# EAGLE design 3D-Druck-Platine_v2_0 (EAGLE 7.4.0)
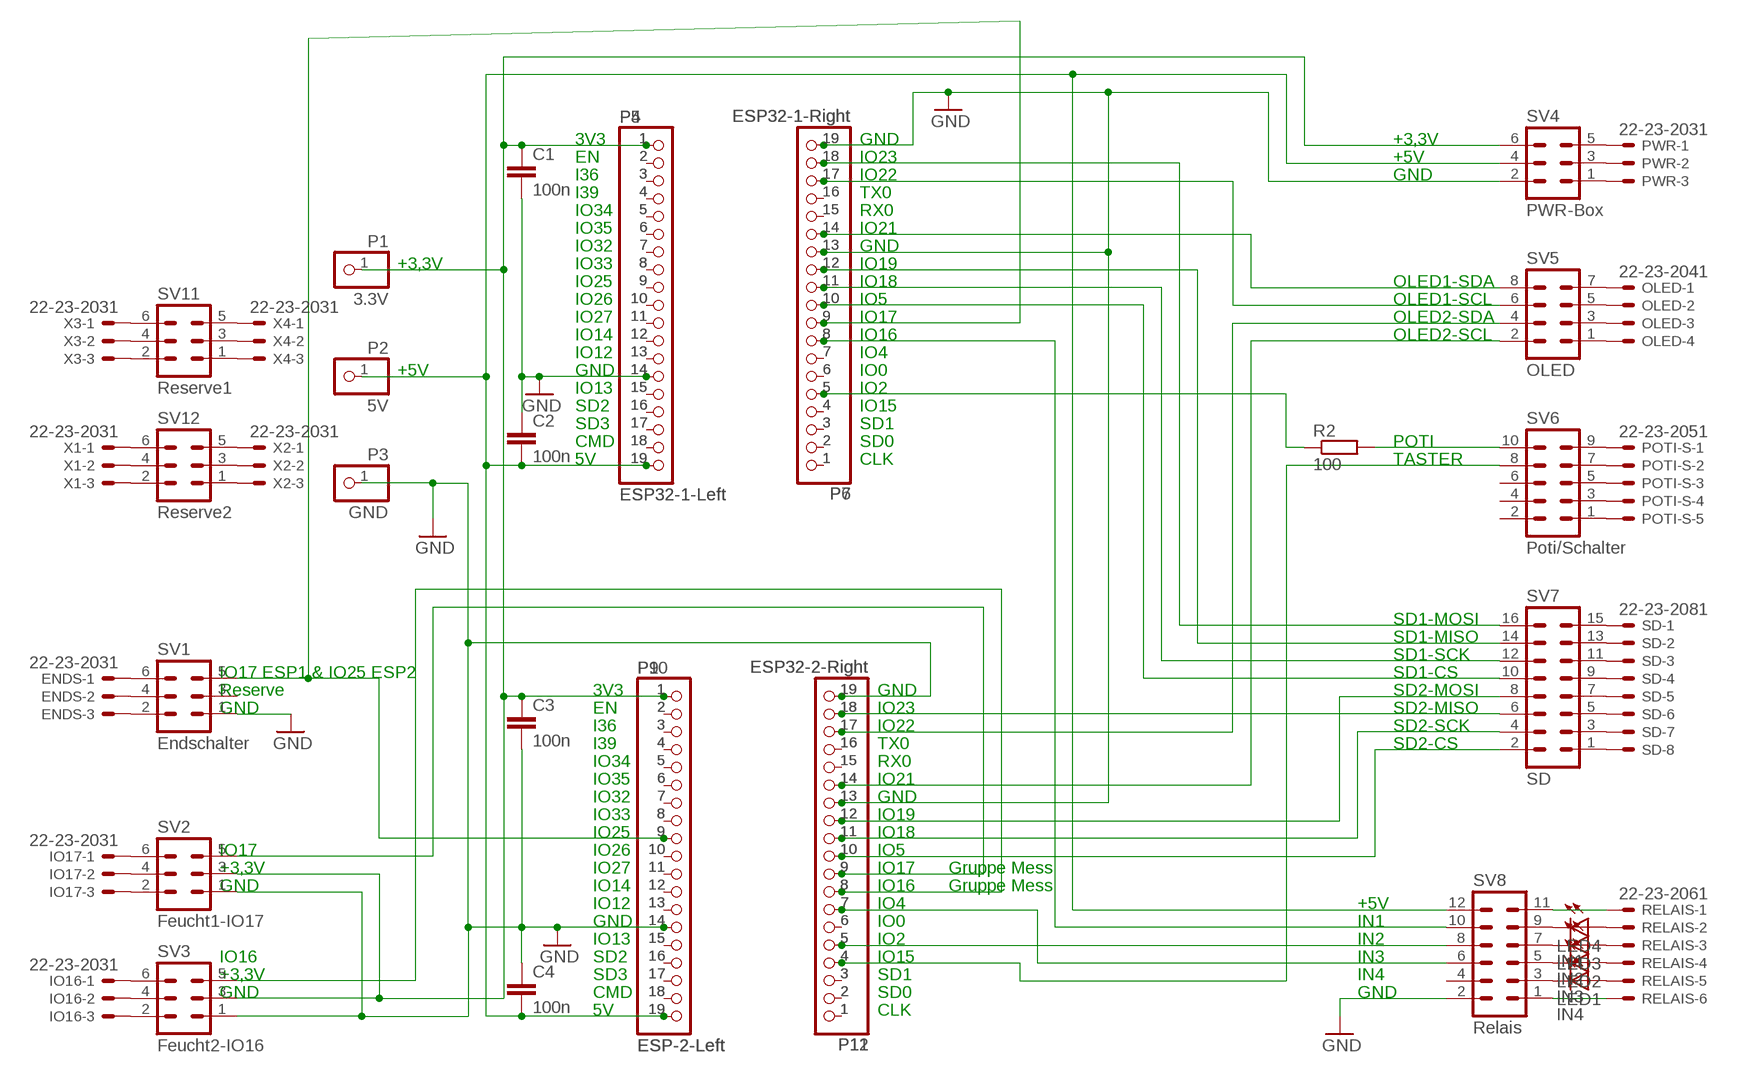
[diagram p0: schematic, sheet 1]

## Parts
C1  100n  C-EU025-024X044  [C025-024X044]
C2  100n  C-EU025-024X044  [C025-024X044]
C3  100n  C-EU025-024X044  [C025-024X044]
C4  100n  C-EU025-024X044  [C025-024X044]
ENDS  22-23-2031  [22-23-2031]
IO16  22-23-2031  [22-23-2031]
IO17  22-23-2031  [22-23-2031]
LED1  IN4  LED3MM  [LED3MM]
LED2  IN3  LED3MM  [LED3MM]
LED3  IN2  LED3MM  [LED3MM]
LED4  IN1  LED3MM  [LED3MM]
OLED  22-23-2041  [22-23-2041]
P1  3.3V  PINHD-1X1  [1X01]
P2  5V  PINHD-1X1  [1X01]
P3  GND  PINHD-1X1  [1X01]
P4  ESP32-1-Left  PINHD-1X19  [1X19]
P5  ESP32-1-Left  PINHD-1X19  [1X19]
P6  ESP32-1-Right  PINHD-1X19  [1X19]
P7  ESP32-1-Right  PINHD-1X19  [1X19]
P9  ESP-2-Left  PINHD-1X19  [1X19]
P10  ESP-2-Left  PINHD-1X19  [1X19]
P11  ESP32-2-Right  PINHD-1X19  [1X19]
P12  ESP32-2-Right  PINHD-1X19  [1X19]
POTI-S  22-23-2051  [22-23-2051]
PWR  22-23-2031  [22-23-2031]
R2  100  R-EU_0207/10  [0207/10]
RELAIS  22-23-2061  [22-23-2061]
SD  22-23-2081  [22-23-2081]
SV1  Endschalter  MA03-2  [MA03-2]
SV2  Feucht1-IO17  MA03-2  [MA03-2]
SV3  Feucht2-IO16  MA03-2  [MA03-2]
SV4  PWR-Box  MA03-2  [MA03-2]
SV5  OLED  MA04-2  [MA04-2]
SV6  Poti/Schalter  MA05-2  [MA05-2]
SV7  SD  MA08-2  [MA08-2]
SV8  Relais  MA06-2  [MA06-2]
SV11  Reserve1  MA03-2  [MA03-2]
SV12  Reserve2  MA03-2  [MA03-2]
X1  22-23-2031  [22-23-2031]
X2  22-23-2031  [22-23-2031]
X3  22-23-2031  [22-23-2031]
X4  22-23-2031  [22-23-2031]

## Nets
GND: C1.2 C2.1 C3.2 C4.1 P3.1 P4.14 P5.14 P6.13 P6.19 P7.13 P7.19 P9.14 P10.14 P11.13 P11.19 P12.13 P12.19 SV1.1 SV2.1 SV3.1 SV4.2 SV8.2
N$1: P4.2 P5.2
N$2: LED4.K(C) SV8.9
N$3: P4.3 P5.3
N$3V: C1.1 C3.1 P1.1 P4.1 P5.1 P9.1 P10.1 SV2.3 SV3.3 SV4.6
N$4: P11.8 P12.8 SV3.5
N$5: LED3.K(C) SV8.7
N$5V: C2.2 C4.2 P2.1 P4.19 P5.19 P9.19 P10.19 SV4.4 SV8.12
N$6: P4.4 P5.4
N$7: P4.5 P5.5
N$8: ENDS.1 SV1.6
N$9: P4.6 P5.6
N$10: IO17.1 SV2.6
N$11: ENDS.2 SV1.4
N$12: ENDS.3 SV1.2
N$13: IO17.2 SV2.4
N$14: IO17.3 SV2.2
N$15: IO16.1 SV3.6
N$16: IO16.2 SV3.4
N$17: IO16.3 SV3.2
N$18: PWR.1 SV4.5
N$19: PWR.2 SV4.3
N$20: LED2.K(C) SV8.5
N$21: P4.7 P5.7
N$22: P4.8 P5.8
N$23: P4.9 P5.9
N$24: P4.10 P5.10
N$25: P4.11 P5.11
N$26: P4.12 P5.12
N$27: P4.13 P5.13
N$28: P4.15 P5.15
N$29: P4.16 P5.16
N$30: P4.17 P5.17
N$31: P4.18 P5.18
N$32: P6.1 P7.1
N$33: P6.2 P7.2
N$34: P6.3 P7.3
N$35: P6.4 P7.4
N$36: PWR.3 SV4.1
N$37: P6.7 P7.7
N$38: P6.15 P7.15
N$39: P6.16 P7.16
N$40: P9.2 P10.2
N$41: P9.3 P10.3
N$42: P9.4 P10.4
N$43: P9.5 P10.5
N$44: P9.6 P10.6
N$45: P9.8 P10.8
N$46: P9.11 P10.11
N$47: P9.12 P10.12
N$48: P9.13 P10.13
N$49: P9.15 P10.15
N$50: P9.16 P10.16
N$51: P9.17 P10.17
N$52: P9.18 P10.18
N$53: P11.1 P12.1
N$54: P11.2 P12.2
N$55: P11.3 P12.3
N$56: OLED.1 SV5.7
N$57: P11.6 P12.6
N$58: P11.15 P12.15
N$59: R2.2 SV6.10
N$60: P6.6 P7.6
N$61: OLED.2 SV5.5
N$62: OLED.3 SV5.3
N$63: OLED.4 SV5.1
N$64: POTI-S.1 SV6.9
N$65: POTI-S.2 SV6.7
N$66: POTI-S.3 SV6.5
N$67: POTI-S.4 SV6.3
N$68: POTI-S.5 SV6.1
N$69: SD.1 SV7.15
N$70: SD.2 SV7.13
N$71: SD.3 SV7.11
N$72: SD.5 SV7.7
N$73: SD.6 SV7.5
N$74: SD.7 SV7.3
N$75: SD.8 SV7.1
N$76: SD.4 SV7.9
N$77: RELAIS.1 SV8.11
N$78: LED1.K(C) SV8.3
N$79: LED4.A RELAIS.2
N$80: LED3.A RELAIS.3
N$81: LED2.A RELAIS.4
N$82: RELAIS.6 SV8.1
N$83: LED1.A RELAIS.5
N$84: SV11.6 X3.1
N$85: SV11.4 X3.2
N$86: SV11.2 X3.3
N$87: SV11.5 X4.1
N$88: SV11.3 X4.2
N$89: SV11.1 X4.3
N$90: SV12.6 X1.1
N$91: SV12.4 X1.2
N$92: SV12.2 X1.3
N$93: SV12.5 X2.1
N$94: SV12.3 X2.2
N$95: SV12.1 X2.3
N$101: P11.16 P12.16
N$ESP1-18: P6.11 P7.11 SV7.12
N$ESP1-IO2: P6.5 P7.5 R2.1
N$ESP1-IO5: P6.10 P7.10 SV7.10
N$ESP1-IO16: P6.8 P7.8 SV8.10
N$ESP1-IO17_ESP2-IO25: P6.9 P7.9 P9.9 P10.9 SV1.5
N$ESP1-IO19: P6.12 P7.12 SV7.14
N$ESP1-IO21: P6.14 P7.14 SV5.8
N$ESP1-IO22: P6.17 P7.17 SV5.6
N$ESP1-IO23: P6.18 P7.18 SV7.16
N$ESP2-IO2: P11.5 P12.5 SV8.8
N$ESP2-IO4: P11.7 P12.7 SV8.6
N$ESP2-IO5: P11.10 P12.10 SV7.2
N$ESP2-IO15: P11.4 P12.4 SV6.8
N$ESP2-IO16: P11.9 P12.9 SV2.5
N$ESP2-IO18: P11.11 P12.11 SV7.4
N$ESP2-IO19: P11.12 P12.12 SV7.8
N$ESP2-IO21: P11.14 P12.14 SV5.2
N$ESP2-IO22: P11.17 P12.17 SV5.4
N$ESP2-IO23: P11.18 P12.18 SV7.6
N$ESP2-IO26: P9.10 P10.10
N$ESP2-IO32: P9.7 P10.7
Unconnected: SV1.3 SV6.2 SV6.4 SV6.6 SV8.4

## Notes on the sheet
- 3V3 | GND | +3,3V
- EN | IO23 | +5V
- I36 | IO22 | GND
- I39 | TX0
- IO34 | RX0
- IO35 | IO21
- IO32 | GND
- +3,3V | IO33 | IO19
- IO25 | IO18 | OLED1-SDA
- IO26 | IO5 | OLED1-SCL
- IO27 | IO17 | OLED2-SDA
- IO14 | IO16 | OLED2-SCL
- IO12 | IO4
- +5V | GND | IO0
- IO13 | IO2
- SD2 | IO15
- SD3 | SD1
- CMD | SD0 | POTI
- 5V | CLK | TASTER
- SD1-MOSI
- SD1-MISO
- SD1-SCK
- IO17 ESP1 & IO25 ESP2 | SD1-CS
- Reserve | 3V3 | GND | SD2-MOSI
- GND | EN | IO23 | SD2-MISO
- I36 | IO22 | SD2-SCK
- I39 | TX0 | SD2-CS
- IO34 | RX0
- IO35 | IO21
- IO32 | GND
- IO33 | IO19
- IO25 | IO18
- IO17 | IO26 | IO5
- +3,3V | IO27 | IO17 | Gruppe Mess
- GND | IO14 | IO16 | Gruppe Mess
- IO12 | IO4 | +5V
- GND | IO0 | IN1
- IO13 | IO2 | IN2
- IO16 | SD2 | IO15 | IN3
- +3,3V | SD3 | SD1 | IN4
- GND | CMD | SD0 | GND
- 5V | CLK

## Library data of the parts
C1-C4 = rcl:C-EU: CAPACITOR, European symbol
ENDS IO16 IO17 PWR X1-X4 = con-molex:22-23-2031: .100" (2.54mm) Center Header - 3 Pin; MF: MOLEX; MPN: 22-23-2031; OC_FARNELL: 1462950; OC_NEWARK: 30C0862
LED1-LED4 = led:LED: LED OSRAM: - CHIPLED LG R971, LG N971, LY N971, LG Q971, LY Q971, LO R971, LY R971 LH N974, LH R974 LS Q976, LO Q976, LY Q976 LO Q996 - Hyper CHIPLED LW Q18S LB Q993, LB Q99A, LB R99A - SideLED LS A670, LO A670, LY A670, LG A670, LP A670 LB A673, LV A673, LT A673, LW A673 LH A674 LY A675 LS A676, LA A676, LO A676, LY A676, LW A676 LS A679, LY A679, LG A679 - Hyper Micro SIDELED® LS Y876, LA Y876, LO Y876, LY Y876 LT Y87S - SmartLED LW L88C, LW L88S LB L89C, LB L89S, LG L890 LS L89K, LO L89K, LY L89K LS L896, LA L896, LO L896, LY L896 - TOPLED LS T670, LO T670, LY T670, LG T670, LP T670 LSG T670, LSP T670, LSY T670, LOP T670, LYG T670 LG T671, LOG T671, LSG T671 LB T673, LV T673, LT T673, LW T673 LH T674 LS T676, LA T676, LO T676, LY T676, LB T676, LH T676, LSB T676, LW T676 LB T67C, LV T67C, LT T67C, LS T67K, LO T67K, LY T67K, LW E67C LS E67B, LA E67B, LO E67B, LY E67B, LB E67C, LV E67C, LT E67C LW T67C LS T679, LY T679, LG T679 LS T770, LO T770, LY T770, LG T770, LP T770 LB T773, LV T773, LT T773, LW T773 LH T774 LS E675, LA E675, LY E675, LS T675 LS T776, LA T776, LO T776, LY T776, LB T776 LHGB T686 LT T68C, LB T68C - Hyper Mini TOPLED® LB M676 - Mini TOPLED Santana® LG M470 LS M47K, LO M47K, LY M47K Source: http://www.osram.convergy.de LUXEON: - LUMILED® LXK2-PW12-R00, LXK2-PW12-S00, LXK2-PW14-U00, LXK2-PW14-V00 LXK2-PM12-R00, LXK2-PM12-S00, LXK2-PM14-U00 LXK2-PE12-Q00, LXK2-PE12-R00, LXK2-PE12-S00, LXK2-PE14-T00, LXK2-PE14-U00 LXK2-PB12-K00, LXK2-PB12-L00, LXK2-PB12-M00, LXK2-PB14-N00, LXK2-PB14-P00, LXK2-PB14-Q00 LXK2-PR12-L00, LXK2-PR12-M00, LXK2-PR14-Q00, LXK2-PR14-R00 LXK2-PD12-Q00, LXK2-PD12-R00, LXK2-PD12-S00 LXK2-PH12-R00, LXK2-PH12-S00 LXK2-PL12-P00, LXK2-PL12-Q00, LXK2-PL12-R00 Source: www.luxeon.com KINGBRIGHT: KA-3528ASYC Source: www.kingbright.com
OLED = con-molex:22-23-2041: .100" (2.54mm) Center Header - 4 Pin; MF: MOLEX; MPN: 22-23-2041; OC_FARNELL: 1462920; OC_NEWARK: 38C0355
P1-P3 = pinhead:PINHD-1X1: PIN HEADER
P4-P7 P9-P12 = pinhead:PINHD-1X19: PIN HEADER
POTI-S = con-molex:22-23-2051: .100" (2.54mm) Center Header - 5 Pin; MF: MOLEX; MPN: 22-23-2051; OC_FARNELL: 1462952; OC_NEWARK: 38C9178
R2 = rcl:R-EU_: RESISTOR, European symbol
RELAIS = con-molex:22-23-2061: .100" (2.54mm) Center Header - 6 Pin; MF: MOLEX; MPN: 22-23-2061; OC_FARNELL: 1462922; OC_NEWARK: 27C1933
SD = con-molex:22-23-2081: .100" (2.54mm) Center Header - 8 Pin; MF: MOLEX; MPN: 22-23-2081; OC_FARNELL: 1756826; OC_NEWARK: 01C7592
SV1-SV4 SV11 SV12 = con-lstb:MA03-2: PIN HEADER; OC_FARNELL: unknown; OC_NEWARK: unknown
SV5 = con-lstb:MA04-2: PIN HEADER; OC_FARNELL: unknown; OC_NEWARK: unknown
SV6 = con-lstb:MA05-2: PIN HEADER; OC_FARNELL: unknown; OC_NEWARK: unknown
SV7 = con-lstb:MA08-2: PIN HEADER; OC_FARNELL: unknown; OC_NEWARK: unknown
SV8 = con-lstb:MA06-2: PIN HEADER; OC_FARNELL: unknown; OC_NEWARK: unknown

## Board
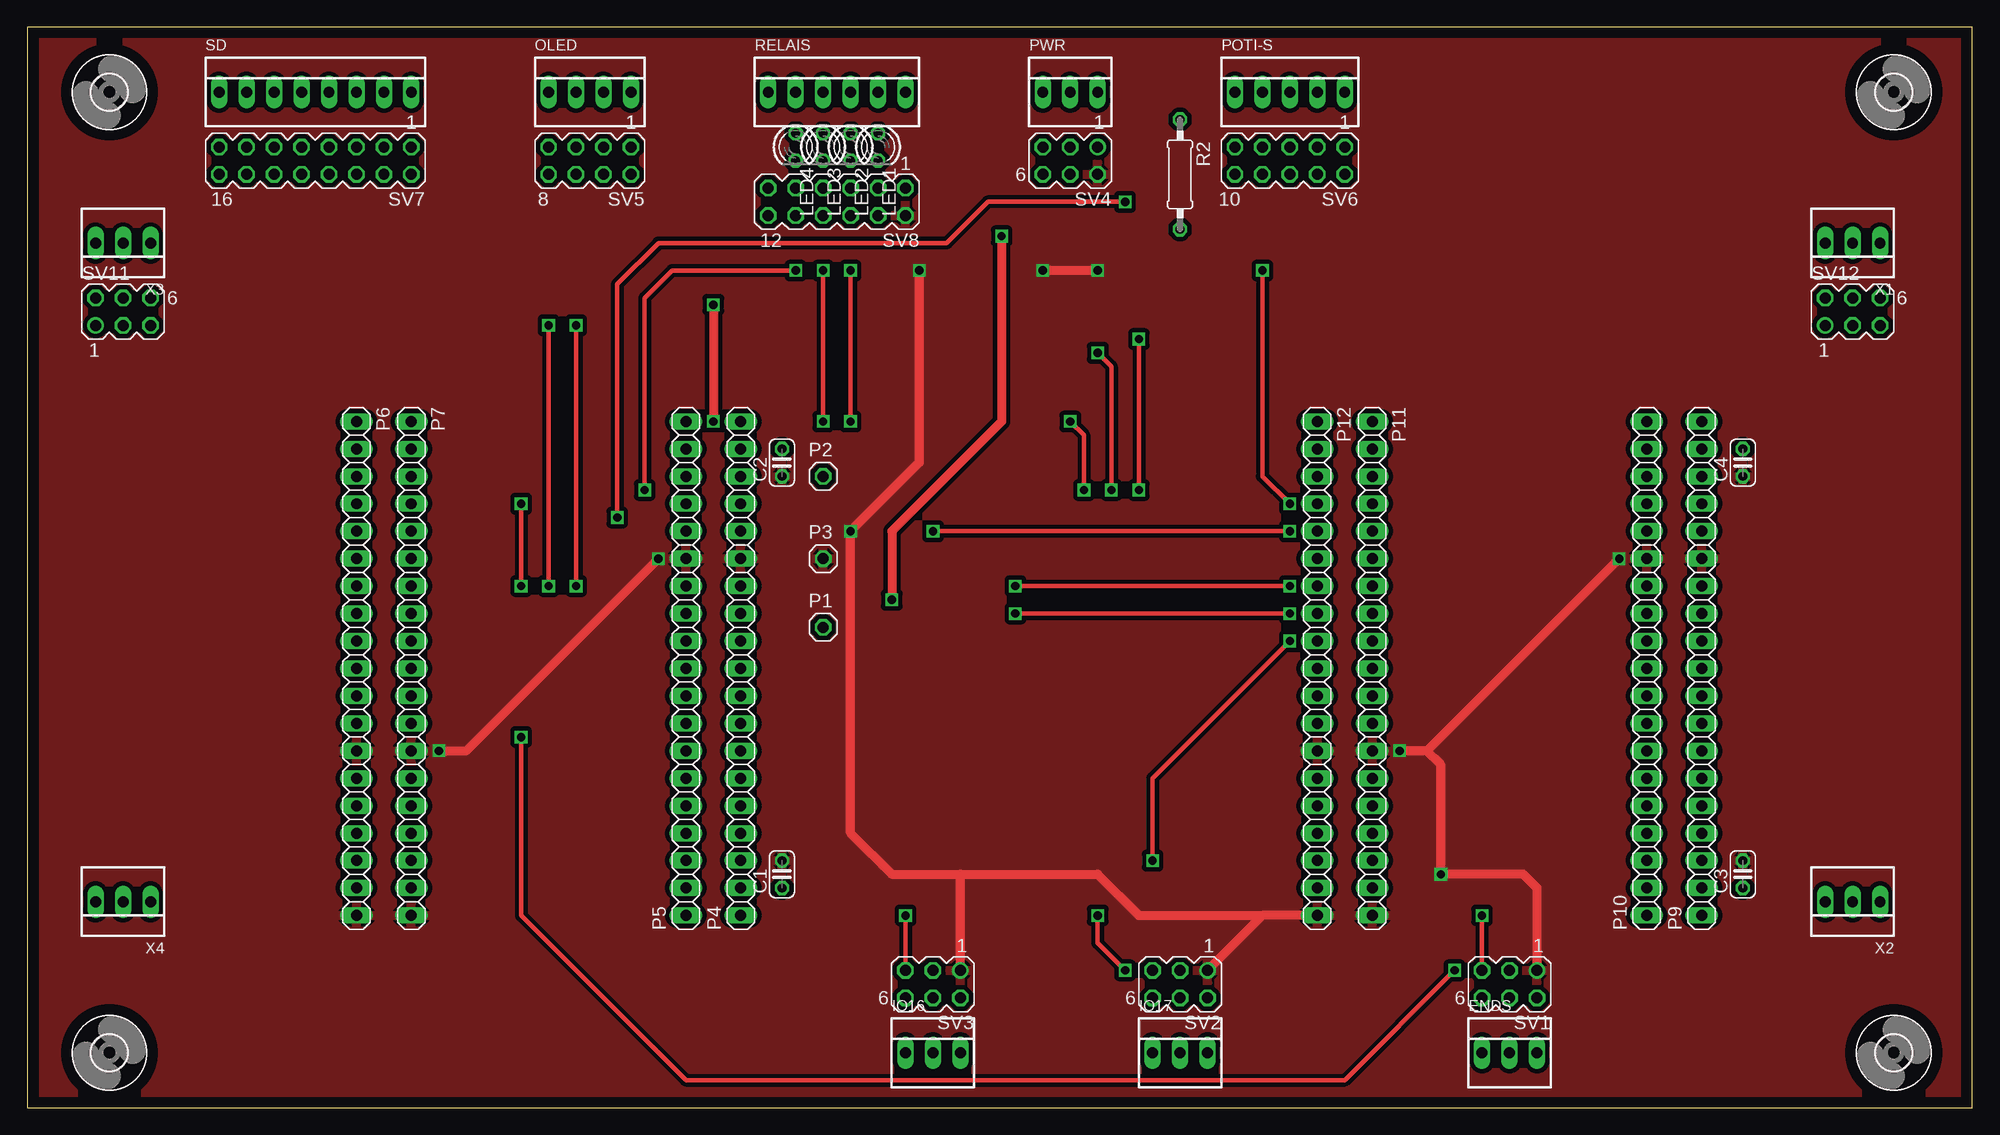
[diagram p1: board, top side]
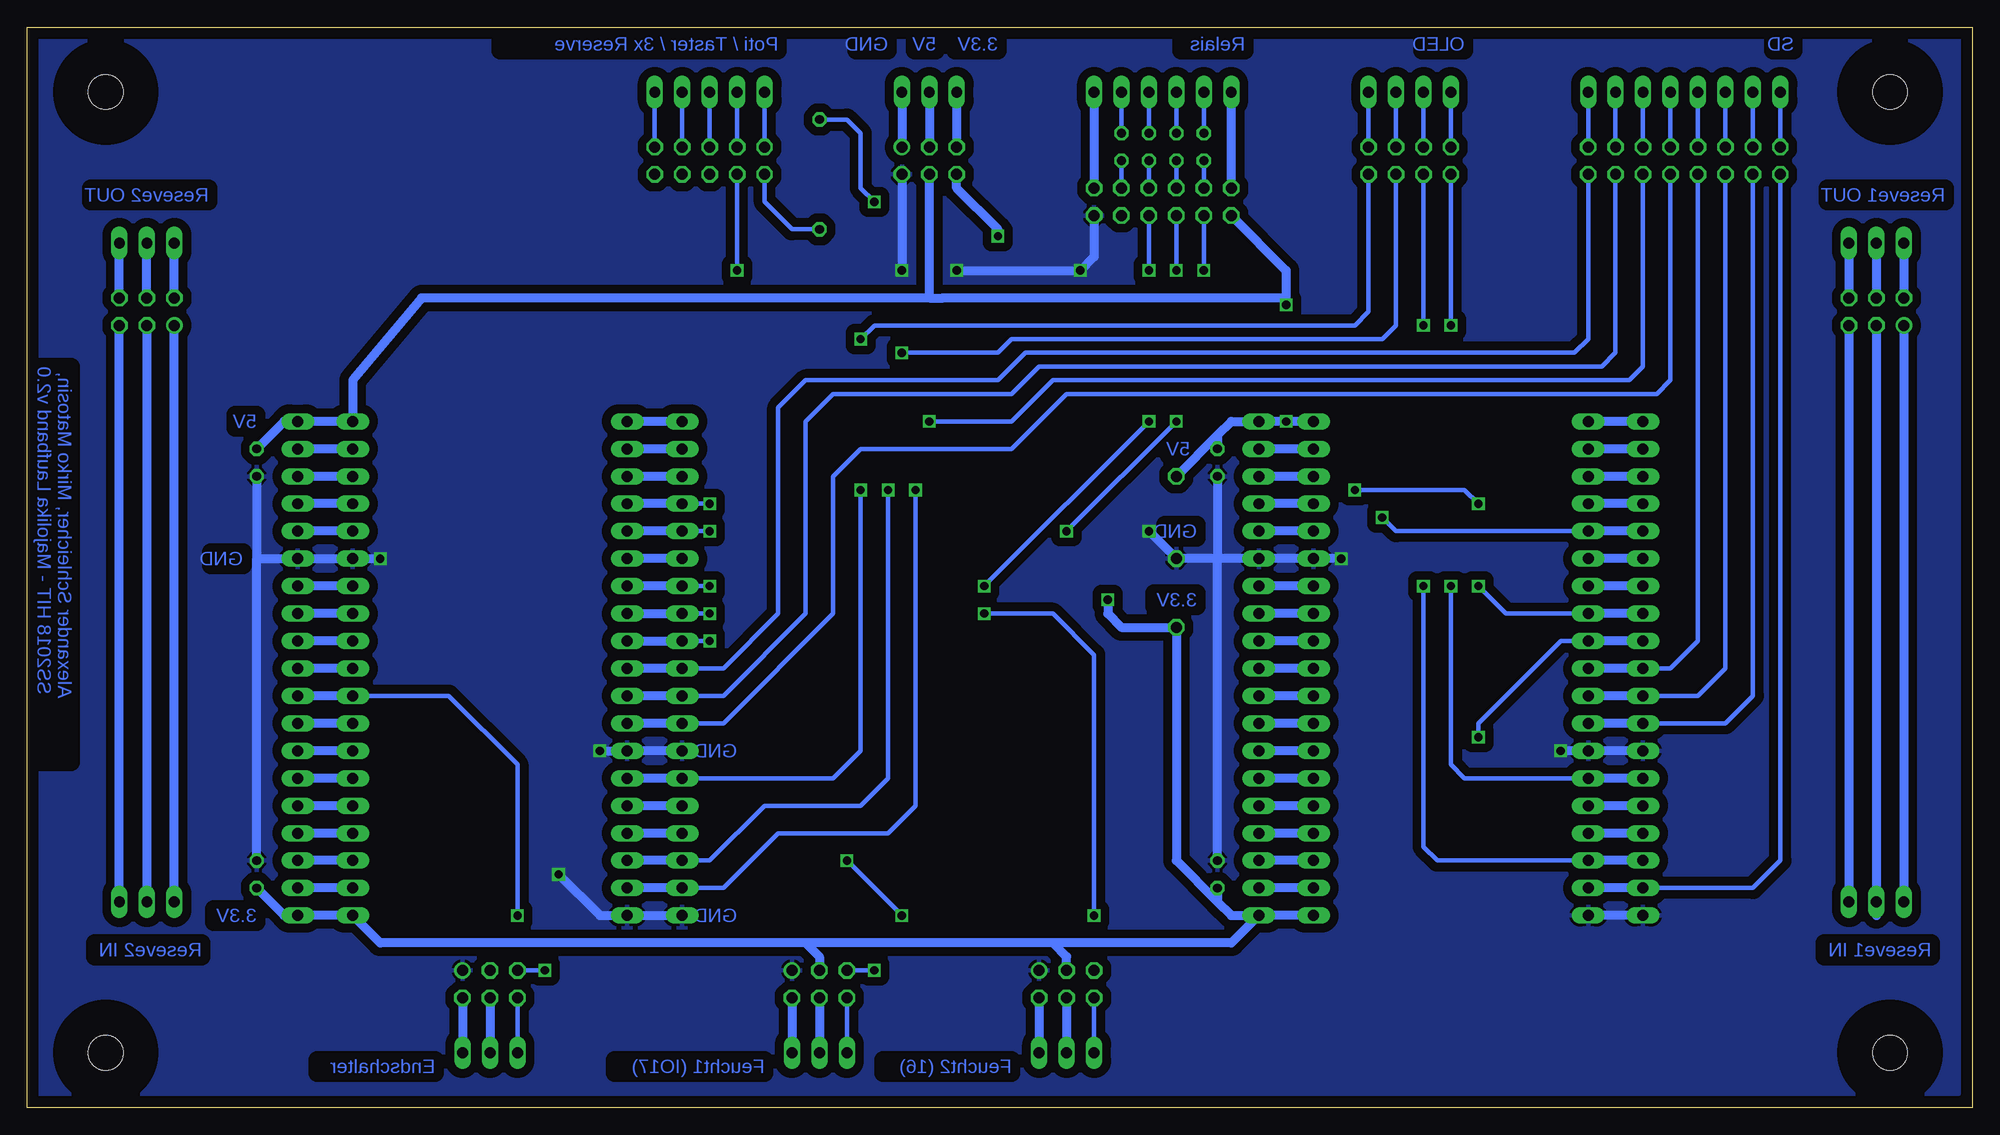
[diagram p2: board, bottom side, seen from below]

Size 180 x 100 mm. Coordinates in mm from the lower left corner, seen from the top.
Outline: 0,0 180,0 180,100 0,100 0,0
Copper layers (1*16): Top 0.035mm / dielectric 1.5mm / Bottom 0.035mm
Design rules "default": minimum track width 10mil, minimum drill 24mil, track to track 8mil, track to pad 8mil, pad to pad 8mil, via to via 8mil, smd to smd 8mil, copper to edge 40mil, drill to drill 8mil, minimum pad ring 10mil, minimum via ring 8mil, stop-mask expansion 4mil, vias tented up to drill 0mil, thermal gap 10mil

### Footprints (pad centres in the part's own frame; a part is rotated, then mirrored left to right if it is on the bottom)
C025-024X044 = drill 0.813 octagon: 1 -1.27,0; 2 1.27,0
22-23-2031 = drill 1 long: 1 -2.54,0; 2 0,0; 3 2.54,0
LED3MM = drill 0.813 octagon: A -1.27,0; K 1.27,0
22-23-2041 = drill 1 long: 1 -3.81,0; 2 -1.27,0; 3 1.27,0; 4 3.81,0
1X01 = drill 1.016 octagon: 1 0,0
1X19 = drill 1.016 long: 1 -22.86,0; 2 -20.32,0; 3 -17.78,0; 4 -15.24,0; 5 -12.7,0; 6 -10.16,0; 7 -7.62,0; 8 -5.08,0; 9 -2.54,0; 10 0,0; 11 2.54,0; 12 5.08,0; 13 7.62,0; 14 10.16,0; 15 12.7,0; 16 15.24,0; 17 17.78,0; 18 20.32,0; 19 22.86,0
22-23-2051 = drill 1 long: 1 -5.08,0; 2 -2.54,0; 3 0,0; 4 2.54,0; 5 5.08,0
0207/10 = drill 0.813 octagon: 1 -5.08,0; 2 5.08,0
22-23-2061 = drill 1 long: 1 -6.35,0; 2 -3.81,0; 3 -1.27,0; 4 1.27,0; 5 3.81,0; 6 6.35,0
22-23-2081 = drill 1 long: 1 -8.89,0; 2 -6.35,0; 3 -3.81,0; 4 -1.27,0; 5 1.27,0; 6 3.81,0; 7 6.35,0; 8 8.89,0
MA03-2 = drill 1.016: 1 -2.54,-1.27 | drill 1.016 octagon: 2 -2.54,1.27; 3 0,-1.27; 4 0,1.27; 5 2.54,-1.27; 6 2.54,1.27
MA04-2 = drill 1.016 octagon: 1 -3.81,-1.27; 2 -3.81,1.27; 3 -1.27,-1.27; 4 -1.27,1.27; 5 1.27,-1.27; 6 1.27,1.27; 7 3.81,-1.27; 8 3.81,1.27
MA05-2 = drill 1.016 octagon: 1 -5.08,-1.27; 2 -5.08,1.27; 3 -2.54,-1.27; 4 -2.54,1.27; 5 0,-1.27; 6 0,1.27; 7 2.54,-1.27; 8 2.54,1.27; 9 5.08,-1.27; 10 5.08,1.27
MA08-2 = drill 1.016 octagon: 1 -8.89,-1.27; 2 -8.89,1.27; 3 -6.35,-1.27; 4 -6.35,1.27; 5 -3.81,-1.27; 6 -3.81,1.27; 7 -1.27,-1.27; 8 -1.27,1.27; 9 1.27,-1.27; 10 1.27,1.27; 11 3.81,-1.27; 12 3.81,1.27; 13 6.35,-1.27; 14 6.35,1.27; 15 8.89,-1.27; 16 8.89,1.27
MA06-2 = drill 1.016 octagon: 1 -6.35,-1.27; 2 -6.35,1.27; 3 -3.81,-1.27; 4 -3.81,1.27; 5 -1.27,-1.27; 6 -1.27,1.27; 7 1.27,-1.27; 8 1.27,1.27; 9 3.81,-1.27; 10 3.81,1.27; 11 6.35,-1.27; 12 6.35,1.27
3,2 = hole 3.2: 0,0

### Placement (x,y rotation side)
C1  69.85,21.59 90 top
C2  69.85,59.69 90 top
C3  158.75,21.59 90 top
C4  158.75,59.69 90 top
ENDS  137.16,5.08 0 top
IO16  83.82,5.08 0 top
IO17  106.68,5.08 0 top
LED1  78.74,88.9 270 top
LED2  76.2,88.9 270 top
LED3  73.66,88.9 270 top
LED4  71.12,88.9 270 top
OLED  52.07,93.98 0 top
P1  73.66,44.45 0 top
P2  73.66,58.42 0 top
P3  73.66,50.8 0 top
P4  66.04,40.64 90 top
P5  60.96,40.64 90 top
P6  30.48,40.64 270 top
P7  35.56,40.64 270 top
P9  154.94,40.64 90 top
P10  149.86,40.64 90 top
P11  124.46,40.64 270 top
P12  119.38,40.64 270 top
POTI-S  116.84,93.98 0 top
PWR  96.52,93.98 0 top
R2  106.68,86.36 270 top
RELAIS  74.93,93.98 0 top
SD  26.67,93.98 0 top
SV1  137.16,11.43 180 top
SV2  106.68,11.43 180 top
SV3  83.82,11.43 180 top
SV4  96.52,87.63 180 top
SV5  52.07,87.63 180 top
SV6  116.84,87.63 180 top
SV7  26.67,87.63 180 top
SV8  74.93,83.82 180 top
SV11  8.89,73.66 0 top
SV12  168.91,73.66 0 top
U$1  [3,2]  7.62,93.98 0 top
U$2  [3,2]  7.62,5.08 0 top
U$3  [3,2]  172.72,93.98 0 top
U$4  [3,2]  172.72,5.08 0 top
X1  168.91,80.01 180 top
X2  168.91,19.05 180 top
X3  8.89,80.01 180 top
X4  8.89,19.05 180 top

### Tracks (layer width: path | path; a pad name or v marks a point on that pad's centre or on a via)
GND  (via drill 0.76)
  Top 0.813: v82.55,77.47 82.55,59.69 v76.2,53.34 76.2,25.4 80.01,21.59 86.36,21.59 | v99.06,77.47 v93.98,77.47 | v147.32,50.8 129.54,33.02 | 129.54,33.02 v127,33.02 | 129.54,33.02 130.81,31.75 v130.81,21.59 138.43,21.59 139.7,20.32 SV1.1 | SV3.1 86.36,21.59 | P12.19 114.3,17.78 | 114.3,17.78 SV2.1 | v38.1,33.02 40.64,33.02 v58.42,50.8 | 86.36,21.59 99.06,21.59 102.87,17.78 114.3,17.78
  Bottom 0.813: 69.85,50.8 P4.14 P5.14 v58.42,50.8 | 69.85,50.8 P3.1 v76.2,53.34 | P6.13 P7.13 v38.1,33.02 | P6.19 P7.19 | P12.13 P11.13 v127,33.02 | v93.98,77.47 v82.55,77.47 81.28,78.74 SV8.2 | v147.32,50.8 P10.14 P9.14 158.75,50.8 | v130.81,21.59 127,17.78 P11.19 P12.19 | C1.2 69.85,50.8 | C4.1 158.75,50.8 | C3.2 158.75,50.8 | C2.1 69.85,50.8 | SV4.2 v99.06,77.47
  pour Bottom (isolate 0.813): 1.27,99.06 179.07,99.06 179.07,87.63 179.07,1.27 1.27,1.27
  pour Top (isolate 0.406): 1.27,99.06 179.07,99.06 179.07,1.27 1.27,1.27
N$1
  Bottom 0.813: P5.2 P4.2
N$2
  Bottom 0.406: LED4.K SV8.9
N$3
  Bottom 0.813: P5.3 P4.3
N$3V  (via drill 0.76)
  Top 0.813: v90.17,80.64 90.17,63.5 80.01,53.34 v80.01,46.99
  Bottom 0.813: P5.1 P4.1 | v90.17,80.64 90.17,81.28 93.98,85.09 SV4.6 | 69.85,19.05 73.66,22.86 P1.1 78.74,44.45 80.01,45.72 v80.01,46.99 | 69.85,19.05 68.58,17.78 P4.1 | 85.09,15.24 68.58,15.24 P4.1 | 85.09,15.24 107.95,15.24 | 107.95,15.24 147.32,15.24 P10.1 P9.1 156.21,17.78 C3.1 | C1.1 69.85,19.05 | 107.95,15.24 106.68,13.97 SV2.3 | SV3.3 83.82,13.97 85.09,15.24
N$4  (via drill 0.76)
  Top 0.406: v91.44,45.72 v116.84,45.72 | v81.28,17.78 SV3.5
  Bottom 0.406: v91.44,45.72 85.09,45.72 81.28,41.91 v81.28,17.78 | v116.84,45.72 P12.8
  Bottom 0.813: P11.8 P12.8
N$5
  Bottom 0.406: LED3.K SV8.7
N$5V  (via drill 0.76)
  Top 0.813: v63.5,74.3 v63.5,63.5
  Bottom 0.813: 63.5,74.93 95.25,74.93 96.52,74.93 | 63.5,74.93 63.5,77.47 SV8.12 | 63.5,74.93 v63.5,74.3 | v63.5,63.5 P4.19 | P5.19 P4.19 | 96.52,74.93 143.51,74.93 149.86,67.31 P10.19 P9.19 156.21,63.5 C4.2 | P4.19 68.58,63.5 69.85,62.23 | 69.85,62.23 C2.2 | 96.52,74.93 SV4.4 | P2.1 69.85,62.23
N$6
  Bottom 0.813: P5.4 P4.4
N$7
  Bottom 0.813: P5.5 P4.5
N$8
  Bottom 0.406: SV1.6 ENDS.1
N$9
  Bottom 0.813: P5.6 P4.6
N$10
  Bottom 0.406: SV2.6 IO17.1
N$11
  Bottom 0.813: SV1.4 ENDS.2
N$12
  Bottom 0.813: SV1.2 ENDS.3
N$13
  Bottom 0.813: SV2.4 IO17.2
N$14
  Bottom 0.813: SV2.2 IO17.3
N$15
  Bottom 0.406: SV3.6 IO16.1
N$16
  Bottom 0.813: SV3.4 IO16.2
N$17
  Bottom 0.813: SV3.2 IO16.3
N$18
  Bottom 0.813: PWR.1 SV4.5
N$19
  Bottom 0.813: PWR.2 SV4.3
N$20
  Bottom 0.406: LED2.K SV8.5
N$21
  Bottom 0.813: P5.7 P4.7
N$22
  Bottom 0.813: P5.8 P4.8
N$23
  Bottom 0.813: P5.9 P4.9
N$24
  Bottom 0.813: P5.10 P4.10
N$25
  Bottom 0.813: P5.11 P4.11
N$26
  Bottom 0.813: P5.12 P4.12
N$27
  Bottom 0.813: P5.13 P4.13
N$28
  Bottom 0.813: P5.15 P4.15
N$29
  Bottom 0.813: P5.16 P4.16
N$30
  Bottom 0.813: P5.17 P4.17
N$31
  Bottom 0.813: P5.18 P4.18
N$32
  Bottom 0.813: P6.1 P7.1
N$33
  Bottom 0.813: P6.2 P7.2
N$34
  Bottom 0.813: P6.3 P7.3
N$35
  Bottom 0.813: P6.4 P7.4
N$36
  Bottom 0.813: PWR.3 SV4.1
N$37
  Bottom 0.813: P6.7 P7.7
N$38
  Bottom 0.813: P6.15 P7.15
N$39
  Bottom 0.813: P6.16 P7.16
N$40
  Bottom 0.813: P10.2 P9.2
N$41
  Bottom 0.813: P10.3 P9.3
N$42
  Bottom 0.813: P10.4 P9.4
N$43
  Bottom 0.813: P10.5 P9.5
N$44
  Bottom 0.813: P10.6 P9.6
N$45
  Bottom 0.813: P10.8 P9.8
N$46
  Bottom 0.813: P10.11 P9.11
N$47
  Bottom 0.813: P10.12 P9.12
N$48
  Bottom 0.813: P10.13 P9.13
N$49
  Bottom 0.813: P10.15 P9.15
N$50
  Bottom 0.813: P10.16 P9.16
N$51
  Bottom 0.813: P10.17 P9.17
N$52
  Bottom 0.813: P10.18 P9.18
N$53
  Bottom 0.813: P12.1 P11.1
N$54
  Bottom 0.813: P12.2 P11.2
N$55
  Bottom 0.813: P12.3 P11.3
N$56
  Bottom 0.406: OLED.1 SV5.7
N$57
  Bottom 0.813: P12.6 P11.6
N$58
  Bottom 0.813: P12.15 P11.15
N$59
  Bottom 0.406: R2.2 109.22,81.28 111.76,83.82 SV6.10
N$60
  Bottom 0.813: P6.6 P7.6
N$61
  Bottom 0.406: OLED.2 SV5.5
N$62
  Bottom 0.406: OLED.3 SV5.3
N$63
  Bottom 0.406: OLED.4 SV5.1
N$64
  Bottom 0.406: POTI-S.1 SV6.9
N$65
  Bottom 0.406: POTI-S.2 SV6.7
N$66
  Bottom 0.406: POTI-S.3 SV6.5
N$67
  Bottom 0.406: POTI-S.4 SV6.3
N$68
  Bottom 0.406: POTI-S.5 SV6.1
N$69
  Bottom 0.406: SD.1 SV7.15
N$70
  Bottom 0.406: SD.2 SV7.13
N$71
  Bottom 0.406: SD.3 SV7.11
N$72
  Bottom 0.406: SD.5 SV7.7
N$73
  Bottom 0.406: SD.6 SV7.5
N$74
  Bottom 0.406: SD.7 SV7.3
N$75
  Bottom 0.406: SD.8 SV7.1
N$76
  Bottom 0.406: SD.4 SV7.9
N$77
  Bottom 0.813: SV8.11 RELAIS.1
N$78
  Bottom 0.406: LED1.K SV8.3
N$79
  Bottom 0.406: RELAIS.2 LED4.A
N$80
  Bottom 0.406: RELAIS.3 LED3.A
N$81
  Bottom 0.406: RELAIS.4 LED2.A
N$82
  Bottom 0.813: RELAIS.6 SV8.1
N$83
  Bottom 0.406: RELAIS.5 LED1.A
N$84
  Bottom 0.813: X3.1 SV11.6
N$85
  Bottom 0.813: X3.2 SV11.4
N$86
  Bottom 0.813: X3.3 SV11.2
N$87
  Bottom 0.813: SV11.5 X4.1
N$88
  Bottom 0.813: SV11.3 X4.2 8.89,17.78
N$89
  Bottom 0.813: SV11.1 X4.3
N$90
  Bottom 0.813: SV12.6 X1.1
N$91
  Bottom 0.813: SV12.4 X1.2
N$92
  Bottom 0.813: SV12.2 X1.3
N$93
  Bottom 0.813: X2.1 SV12.5
N$94
  Bottom 0.813: SV12.3 X2.2
N$95
  Bottom 0.813: X2.3 SV12.1
N$101
  Bottom 0.813: P12.16 P11.16
N$ESP1-18
  Bottom 0.406: P6.11 25.4,38.1 22.86,40.64 SV7.12
  Bottom 0.813: P6.11 P7.11
N$ESP1-IO2  (via drill 0.76)
  Top 0.406: v101.6,83.82 88.9,83.82 85.09,80.01 58.42,80.01 54.61,76.2 v54.61,54.61
  Bottom 0.406: R2.1 104.14,91.44 102.87,90.17 102.87,85.09 v101.6,83.82 | P7.5 53.34,53.34 v54.61,54.61
  Bottom 0.813: P6.5 P7.5
N$ESP1-IO5
  Bottom 0.406: P6.10 27.94,40.64 25.4,43.18 SV7.10
  Bottom 0.813: P6.10 P7.10
N$ESP1-IO16  (via drill 0.76)
  Top 0.406: v71.12,77.47 59.69,77.47 57.15,74.93 v57.15,57.15 | v45.72,55.88 v45.72,48.26
  Bottom 0.406: P7.8 43.18,45.72 v45.72,48.26 | v71.12,77.47 SV8.10 | v57.15,57.15 46.99,57.15 v45.72,55.88
  Bottom 0.813: P6.8 P7.8
N$ESP1-IO17_ESP2-IO25  (via drill 0.76)
  Top 0.406: v45.72,34.29 45.72,17.78 60.96,2.54 121.92,2.54 v132.08,12.7 | v134.62,17.78 SV1.5
  Bottom 0.406: P10.9 140.97,38.1 134.62,31.75 v134.62,17.78 | P7.9 38.1,43.18 45.72,35.56 v45.72,34.29 | v132.08,12.7 SV1.5
  Bottom 0.813: P6.9 P7.9 | P10.9 P9.9
N$ESP1-IO19
  Bottom 0.406: P6.12 22.86,35.56 20.32,38.1 SV7.14
  Bottom 0.813: P6.12 P7.12
N$ESP1-IO21  (via drill 0.76)
  Top 0.406: v48.26,72.39 v48.26,48.26
  Bottom 0.406: v48.26,48.26 48.26,31.75 46.99,30.48 P7.14 | v48.26,72.39 SV5.8
  Bottom 0.813: P6.14 P7.14
N$ESP1-IO22  (via drill 0.76)
  Top 0.406: v50.8,72.39 v50.8,48.26
  Bottom 0.406: v50.8,48.26 50.8,24.13 49.53,22.86 P7.17 | v50.8,72.39 SV5.6
  Bottom 0.813: P6.17 P7.17
N$ESP1-IO23
  Bottom 0.406: P6.18 20.32,20.32 17.78,22.86 SV7.16
  Bottom 0.813: P6.18 P7.18
N$ESP2-IO2  (via drill 0.76)
  Top 0.406: v73.66,77.47 v73.66,63.5 | v83.82,53.34 v116.84,53.34
  Bottom 0.406: v73.66,63.5 v83.82,53.34 | v116.84,53.34 P12.5 | v73.66,77.47 SV8.8
  Bottom 0.813: P12.5 P11.5
N$ESP2-IO4  (via drill 0.76)
  Top 0.406: v76.2,77.47 v76.2,63.5 | v91.44,48.26 v116.84,48.26
  Bottom 0.406: v76.2,63.5 v91.44,48.26 | v116.84,48.26 P12.7 | v76.2,77.47 SV8.6
  Bottom 0.813: P12.7 P11.7
N$ESP2-IO5
  Bottom 0.406: P12.10 115.57,40.64 110.49,45.72 110.49,64.77 107.95,67.31 90.17,67.31 87.63,69.85 36.83,69.85 35.56,71.12 SV7.2
  Bottom 0.813: P12.10 P11.10
N$ESP2-IO15  (via drill 0.76)
  Top 0.406: v114.3,77.47 114.3,58.42 v116.84,55.88
  Bottom 0.406: v116.84,55.88 P12.4 | v114.3,77.47 SV6.8
  Bottom 0.813: P12.4 P11.4
N$ESP2-IO16  (via drill 0.76)
  Top 0.406: v116.84,43.18 104.14,30.48 v104.14,22.86 | v99.06,17.78 99.06,15.24 v101.6,12.7
  Bottom 0.406: P12.9 v116.84,43.18 | v104.14,22.86 v99.06,17.78 | v101.6,12.7 SV2.5
  Bottom 0.813: P11.9 P12.9
N$ESP2-IO18
  Bottom 0.406: P12.11 115.57,38.1 107.95,45.72 107.95,63.5 105.41,66.04 88.9,66.04 86.36,68.58 34.29,68.58 33.02,69.85 SV7.4
  Bottom 0.813: P12.11 P11.11
N$ESP2-IO19
  Bottom 0.406: P12.12 115.57,35.56 105.41,45.72 105.41,58.42 102.87,60.96 88.9,60.96 83.82,66.04 29.21,66.04 27.94,67.31 SV7.8
  Bottom 0.813: P12.12 P11.12
N$ESP2-IO21  (via drill 0.76)
  Top 0.406: v102.87,71.12 v102.87,57.15
  Bottom 0.406: v102.87,71.12 101.6,72.39 57.15,72.39 55.88,73.66 SV5.2 | v102.87,57.15 102.87,33.02 105.41,30.48 P12.14
  Bottom 0.813: P12.14 P11.14
N$ESP2-IO22  (via drill 0.76)
  Top 0.406: v99.06,69.85 100.33,68.58 v100.33,57.15
  Bottom 0.406: v100.33,57.15 100.33,30.48 102.87,27.94 111.76,27.94 116.84,22.86 P12.17 | SV5.4 53.34,72.39 54.61,71.12 88.9,71.12 90.17,69.85 v99.06,69.85
  Bottom 0.813: P12.17 P11.17
N$ESP2-IO23  (via drill 0.76)
  Top 0.406: v96.52,63.5 97.79,62.23 v97.79,57.15
  Bottom 0.406: v97.79,57.15 97.79,27.94 100.33,25.4 110.49,25.4 115.57,20.32 P12.18 | SV7.6 30.48,68.58 31.75,67.31 85.09,67.31 88.9,63.5 v96.52,63.5
  Bottom 0.813: P12.18 P11.18
N$ESP2-IO26
  Bottom 0.813: P10.10 P9.10
N$ESP2-IO32
  Bottom 0.813: P10.7 P9.7

### Text on the board
Bottom: SD | OLED | Relais | 3.3V | 5V | GND | Poti / Taster / 3x Reserve | Reseve1 OUT | Reseve2 OUT | Alexander Schleicher, Mirko Matosin, / SS2018 HIT - Majolika Laufband v2.0 | 5V | 5V | GND | GND | 3.3V | GND | GND | 3.3V | Reseve1 IN | Reseve2 IN | Feucht2 (16) | Feucht1 (IO17) | Endschalter